# EAGLE design Motherboard 8bot (EAGLE 9.2.0)
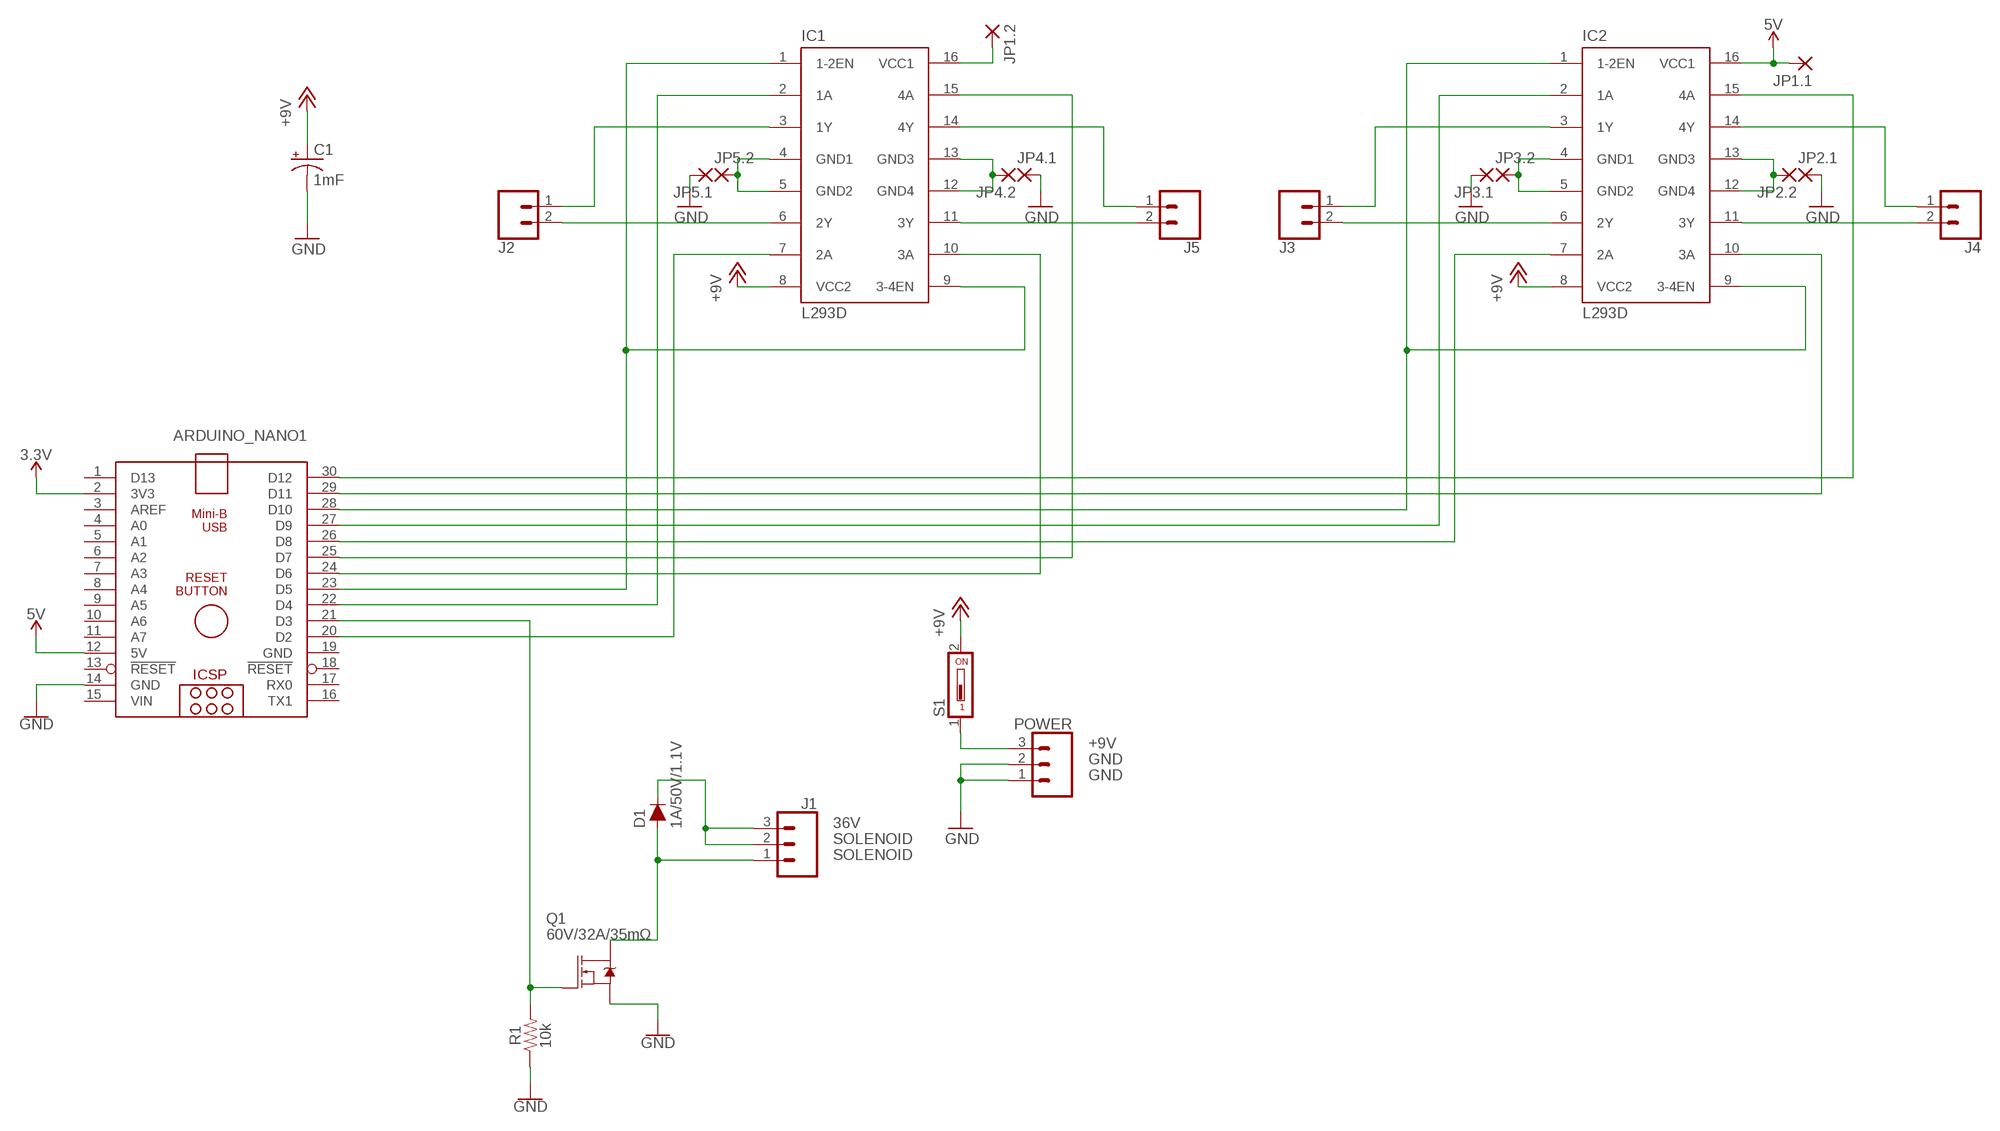
[diagram p0: schematic, sheet 1]

## Parts
ARDUINO_NANO1  ARDUINO_NANO  [ARDUINO_NANO]
C1  1mF  1000UF-RADIAL-5MM-25V-20%  [CPOL-RADIAL-5MM-10MM]
D1  1A/50V/1.1V  DIODE-PTH  [DIODE-1N4001]
IC1  L293D  [DIL16]
IC2  L293D  [DIL16]
J1  CONN_03-SCREW-5MM  [SCREWTERMINAL-5MM-3]
J2  CONN_02  [1X02]
J3  CONN_02  [1X02]
J4  CONN_02  [1X02]
J5  CONN_02  [1X02]
JP1.1  1,6/0,8  [1,6/0,8]
JP1.2  1,6/0,8  [1,6/0,8]
JP2.1  1,6/0,8  [1,6/0,8]
JP2.2  1,6/0,8  [1,6/0,8]
JP3.1  1,6/0,8  [1,6/0,8]
JP3.2  1,6/0,8  [1,6/0,8]
JP4.1  1,6/0,8  [1,6/0,8]
JP4.2  1,6/0,8  [1,6/0,8]
JP5.1  1,6/0,8  [1,6/0,8]
JP5.2  1,6/0,8  [1,6/0,8]
POWER  CONN_03-SCREW-5MM  [SCREWTERMINAL-5MM-3]
Q1  60V/32A/35mΩ  MOSFET-NCH-FQP30N06L  [TO220V]
R1  10k  10KOHM-HORIZ-1/4W-5%  [AXIAL-0.3]
S1  DS01  [DS-01]

## Nets
3.3V: ARDUINO_NANO1.2(3V3)
5V: ARDUINO_NANO1.12(5V) IC2.16(VCC1) JP1.1.1(P)
36V [36V]: D1.C J1.2 J1.3
+9V [9V]: C1.+ IC1.8(VCC2) IC2.8(VCC2) S1.2
EN1: ARDUINO_NANO1.23(D5) IC1.1(1-2EN) IC1.9(3-4EN)
EN2: ARDUINO_NANO1.28(D10) IC2.1(1-2EN) IC2.9(3-4EN)
GND: ARDUINO_NANO1.14(GND) C1.- JP2.1.1(P) JP3.1.1(P) JP4.1.1(P) JP5.1.1(P) POWER.1 POWER.2 Q1.3(S) R1.P$1
N$1: ARDUINO_NANO1.21(D3) Q1.1(G) R1.P$2
N$2: IC1.3(1Y) J2.1
N$3: IC1.6(2Y) J2.2
N$4: IC1.14(4Y) J5.1
N$5: IC1.11(3Y) J5.2
N$6: ARDUINO_NANO1.20(D2) IC1.7(2A)
N$7: ARDUINO_NANO1.22(D4) IC1.2(1A)
N$8: ARDUINO_NANO1.24(D6) IC1.10(3A)
N$9: IC2.3(1Y) J3.1
N$10: IC2.6(2Y) J3.2
N$11: IC2.14(4Y) J4.1
N$12: IC2.11(3Y) J4.2
N$13: IC1.16(VCC1) JP1.2.1(P)
N$14: ARDUINO_NANO1.27(D9) IC2.2(1A)
N$15: ARDUINO_NANO1.25(D7) IC1.15(4A)
N$16: ARDUINO_NANO1.29(D11) IC2.10(3A)
N$17: ARDUINO_NANO1.26(D8) IC2.7(2A)
N$18: ARDUINO_NANO1.30(D12) IC2.15(4A)
N$19: IC1.4(GND1) IC1.5(GND2) JP5.2.1(P)
N$20 [9V]: POWER.3 S1.1
N$21: IC1.12(GND4) IC1.13(GND3) JP4.2.1(P)
N$22: IC2.4(GND1) IC2.5(GND2) JP3.2.1(P)
N$23: IC2.12(GND4) IC2.13(GND3) JP2.2.1(P)
SOLENOID [36V]: D1.A J1.1 Q1.2(D)
Unconnected: ARDUINO_NANO1.1(D13) ARDUINO_NANO1.3(AREF) ARDUINO_NANO1.4(A0) ARDUINO_NANO1.5(A1) ARDUINO_NANO1.6(A2) ARDUINO_NANO1.7(A3) ARDUINO_NANO1.8(A4) ARDUINO_NANO1.9(A5) ARDUINO_NANO1.10(A6) ARDUINO_NANO1.11(A7) ARDUINO_NANO1.13(!RESET) ARDUINO_NANO1.16(TX1) ARDUINO_NANO1.17(RX0) ARDUINO_NANO1.18(!RESET)

## Power pins joined to a net without a drawn wire
GND: ARDUINO_NANO1.19(GND)
VIN: ARDUINO_NANO1.15(VIN)

## Library data of the parts
ARDUINO_NANO1 = ArduinoNanoV30:ARDUINO_NANO: Arduino Nano V3.0 Overview: The Arduino Nano is a small, complete, and breadboard-friendly board based on the ATmega328 (Arduino Nano 3.x) or ATmega168 (Arduino Nano 2.x). It has more or less the same functionality of the Arduino Duemilanove, but in a different package. It lacks only a DC power jack, and works with a Mini-B USB cable instead of a standard one. The Nano was designed and is being produced by Gravitech. Specifications: Microcontroller Atmel ATmega168 or ATmega328 Operating Voltage (logic level) 5 V Input Voltage (recommended) 7-12 V Input Voltage (limits) 6-20 V Digital I/O Pins 14 (of which 6 provide PWM output) Analog Input Pins 8 DC Current per I/O Pin 40 mA Flash Memory 16 KB (ATmega168) or 32 KB (ATmega328) of which 2 KB used by bootloader SRAM 1 KB (ATmega168) or 2 KB (ATmega328) EEPROM 512 bytes (ATmega168) or 1 KB (ATmega328) Clock Speed 16 MHz Dimensions 0.73" x 1.70" Length 45 mm Width 18 mm Weigth 5 g Power: The Arduino Nano can be powered via the Mini-B USB connection, 6-20V unregulated external power supply (pin 30), or 5V regulated external power supply (pin 27). The power source is automatically selected to the highest voltage source. Memory: The ATmega168 has 16 KB of flash memory for storing code (of which 2 KB is used for the bootloader); the ATmega328 has 32 KB, (also with 2 KB used for the bootloader). The ATmega168 has 1 KB of SRAM and 512 bytes of EEPROM (which can be read and written with the EEPROM library); the ATmega328 has 2 KB of SRAM and 1 KB of EEPROM. Input and Output: Each of the 14 digital pins on the Nano can be used as an input or output, using pinMode(), digitalWrite(), and digitalRead() functions. They operate at 5 volts. Each pin can provide or receive a maximum of 40 mA and has an internal pull-up resistor (disconnected by default) of 20-50 kOhms. In addition, some pins have specialized functions. Visit Arduino - ArduinoBoardNano <https://www.arduino.cc/en/Main/ArduinoBoardNano>
C1 = SparkFun-Capacitors:1000UF: 1,000µF/1mF ceramic capacitors A capacitor is a passive two-terminal electrical component used to store electrical energy temporarily in an electric field. CAP-08070; PROD_ID: CAP-09538
D1 = SparkFun-DiscreteSemi:DIODE: Diode These are standard reverse protection diodes and small signal diodes. SparkFun Products: SparkFun SparkPunk Sound Kit <https://www.sparkfun.com/products/11177> SparkFun ESP8266 Thing <https://www.sparkfun.com/products/13231>; PROD_ID: DIO-09176
IC1 IC2 = st-microelectronics:L293D: PUSH-PULL 4 CHANNEL DRIVER; MPN: L293D; OC_FARNELL: 9589619; OC_NEWARK: 56P8249
J1 POWER = SparkFun-Connectors:CONN_03: Multi connection point. Often used as Generic Header-pin footprint for 0.1 inch spaced/style header connections On any of the 0.1 inch spaced packages, you can populate with these: Break Away Headers - Straight <https://www.sparkfun.com/products/116> (PRT-00116) Break Away Male Headers - Right Angle <https://www.sparkfun.com/products/553> (PRT-00553) Female Headers <https://www.sparkfun.com/products/115> (PRT-00115) Break Away Headers - Machine Pin <https://www.sparkfun.com/products/117> (PRT-00117) Break Away Female Headers - Swiss Machine Pin <https://www.sparkfun.com/products/743> (PRT-00743) Stackable Header - 3 Pin (Female, 0.1") <https://www.sparkfun.com/products/13875> (PRT-13875) For SCREWTERMINALS and SPRING TERMINALS visit here: Screw Terimnals on SparkFun.com <https://www.sparkfun.com/search/results?term=Screw+Terminals> (5mm/3.5mm/2.54mm spacing) This device is also useful as a general connection point to wire up your design to another part of your project. Our various solder wires solder well into these plated through hole pads. Hook-Up Wire - Assortment (Stranded, 22 AWG) <https://www.sparkfun.com/products/11375> (PRT-11375) Hook-Up Wire - Assortment (Solid Core, 22 AWG) <https://www.sparkfun.com/products/11367> (PRT-11367) View the entire wire category on our website here <https://www.sparkfun.com/categories/141> Special notes: Molex polarized connector foot print use with SKU : PRT-08232 with associated crimp pins and housings.; PROD_ID: CONN-10134; SF_SKU: PRT-08433
J2-J5 = SparkFun-Connectors:CONN_02: Multi connection point. Often used as Generic Header-pin footprint for 0.1 inch spaced/style header connections On any of the 0.1 inch spaced packages, you can populate with these: Break Away Headers - Straight <https://www.sparkfun.com/products/116> (PRT-00116) Break Away Male Headers - Right Angle <https://www.sparkfun.com/products/553> (PRT-00553) Female Headers <https://www.sparkfun.com/products/115> (PRT-00115) Break Away Headers - Machine Pin <https://www.sparkfun.com/products/117> (PRT-00117) Break Away Female Headers - Swiss Machine Pin <https://www.sparkfun.com/products/743> (PRT-00743) For SCREWTERMINALS and SPRING TERMINALS visit here: Screw Terimnals on SparkFun.com <https://www.sparkfun.com/search/results?term=Screw+Terminals> (5mm/3.5mm/2.54mm spacing) This device is also useful as a general connection point to wire up your design to another part of your project. Our various solder wires solder well into these plated through hole pads. Hook-Up Wire - Assortment (Stranded, 22 AWG) <https://www.sparkfun.com/products/11375> (PRT-11375) Hook-Up Wire - Assortment (Solid Core, 22 AWG) <https://www.sparkfun.com/products/11367> (PRT-11367) View the entire wire category on our website here <https://www.sparkfun.com/categories/141> Special notes: Molex polarized connector foot print use with: PRT-08233 with associated crimp pins and housings. 2.54_SCREWTERM for use with PRT-10571. 3.5mm Screw Terminal footprints for PRT-08084 5mm Screw Terminal footprints for use with PRT-08432
JP1.1 JP1.2 JP2.1 JP2.2 JP3.1 JP3.2 JP4.1 JP4.2 JP5.1 JP5.2 = wirepad:1,6/0,8: THROUGH-HOLE PAD
Q1 = SparkFun-DiscreteSemi:MOSFET-NCH: N-channel MOSFETs Voltage controlled devices that allow control of high current outputs. SparkFun Products: SparkFun OpenScale <https://www.sparkfun.com/products/13261> SparkFun Digital Sandbox <https://www.sparkfun.com/products/12651> SparkFun Monster Moto Shield <https://www.sparkfun.com/products/10182> SparkFun MOSFET Power Controller <https://www.sparkfun.com/products/11214>; PROD_ID: TRANS-10060
R1 = SparkFun-Resistors:10KOHM: 10kΩ resistor A resistor is a passive two-terminal electrical component that implements electrical resistance as a circuit element. Resistors act to reduce current flow, and, at the same time, act to lower voltage levels within circuits. - Wikipedia; PROD_ID: RES-09435
S1 = switch-dil:DS01: DIL/CODE SWITCH; OC_FARNELL: unknown; OC_NEWARK: unknown

## Board
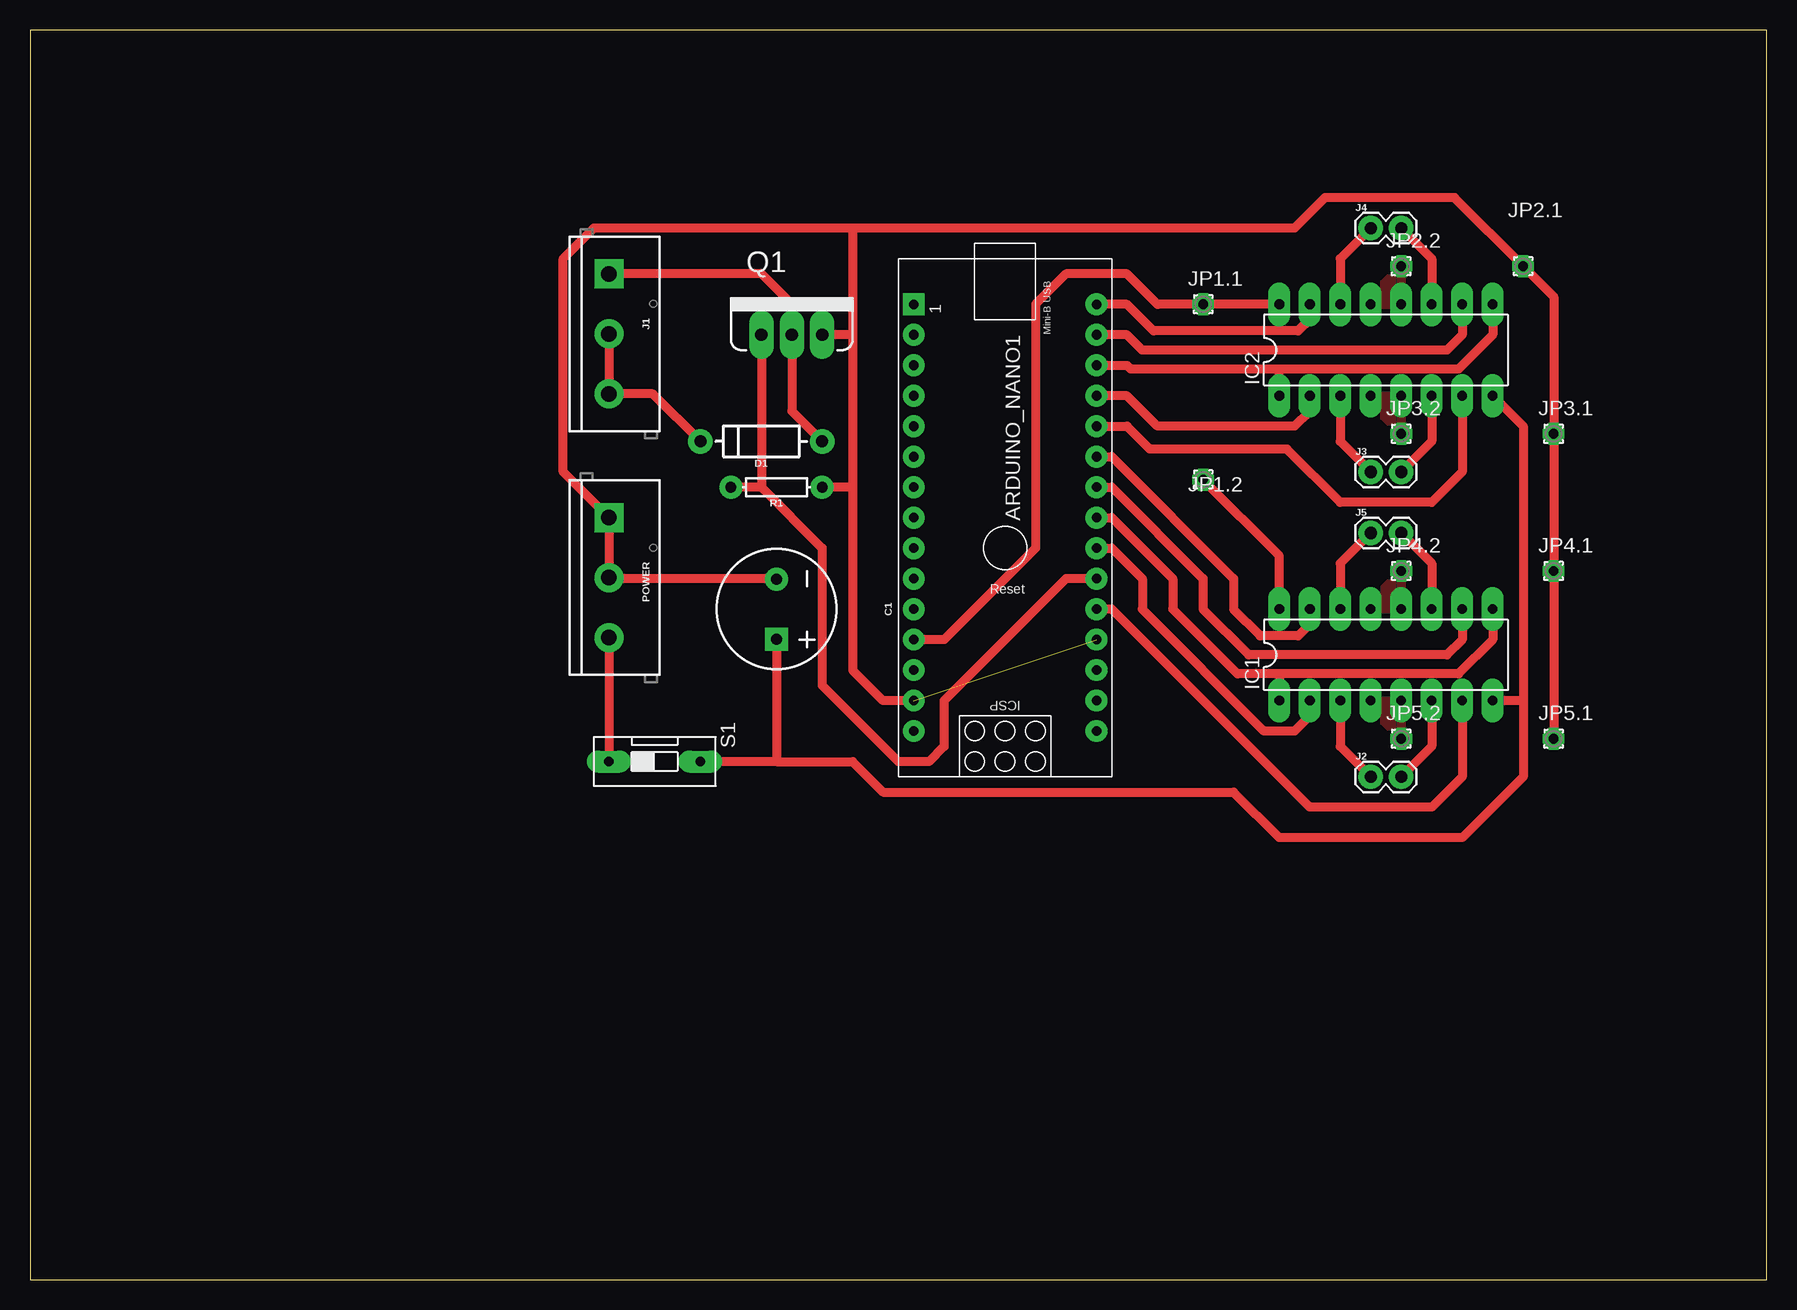
[diagram p1: board, top side]

Size 144.78 x 104.14 mm. Coordinates in mm from the lower left corner, seen from the top.
Outline: 0,0 144.78,0 144.78,104.14 0,104.14 0,0
Copper layers (1*16): Top 0.035mm / dielectric 1.5mm / Bottom 0.035mm
Design rules "Webb_PCB *": minimum track width 30mil, minimum drill 20mil, track to track 30mil, track to pad 30mil, pad to pad 20mil, via to via 20mil, smd to smd 10mil, copper to edge 100mil, drill to drill 20mil, minimum pad ring 20mil, minimum via ring 8mil, stop-mask expansion 4mil, vias tented up to drill 0mil, thermal gap 0mil

### Footprints (pad centres in the part's own frame; a part is rotated, then mirrored left to right if it is on the bottom)
ARDUINO_NANO = drill 0.8 square: 1 -20.32,-7.62 | drill 0.8: 2 -17.78,-7.62; 3 -15.24,-7.62; 4 -12.7,-7.62; 5 -10.16,-7.62; 6 -7.62,-7.62; 7 -5.08,-7.62; 8 -2.54,-7.62; 9 0,-7.62; 10 2.54,-7.62; 11 5.08,-7.62; 12 7.62,-7.62; 13 10.16,-7.62; 14 12.7,-7.62; 15 15.24,-7.62; 16 15.24,7.62; 17 12.7,7.62; 18 10.16,7.62; 19 7.62,7.62; 20 5.08,7.62; 21 2.54,7.62; 22 0,7.62; 23 -2.54,7.62; 24 -5.08,7.62; 25 -7.62,7.62; 26 -10.16,7.62; 27 -12.7,7.62; 28 -15.24,7.62; 29 -17.78,7.62; 30 -20.32,7.62
CPOL-RADIAL-5MM-10MM = drill 0.9 pad 1.93 square: + 2.5,0 | drill 0.9 pad 1.93: - -2.5,0
DIODE-1N4001 = drill 1 pad 1.981: A -5.08,0; C 5.08,0
DIL16 = drill 0.813 long: 1 -8.89,-3.81; 2 -6.35,-3.81; 3 -3.81,-3.81; 4 -1.27,-3.81; 5 1.27,-3.81; 6 3.81,-3.81; 7 6.35,-3.81; 8 8.89,-3.81; 9 8.89,3.81; 10 6.35,3.81; 11 3.81,3.81; 12 1.27,3.81; 13 -1.27,3.81; 14 -3.81,3.81; 15 -6.35,3.81; 16 -8.89,3.81
SCREWTERMINAL-5MM-3 = drill 1.3 pad 2.413 square: 1 0,0 | drill 1.3 pad 2.413: 2 5,0; 3 10,0
1X02 = drill 1.016 pad 1.88: 1 0,0; 2 2.54,0
1,6/0,8 = drill 0.813 pad 1.6 octagon: 1 0,0
TO220V = drill 1.016 long: 1 -2.54,0; 2 0,0; 3 2.54,0
AXIAL-0.3 = drill 0.9 pad 1.88: P$1 -3.81,0; P$2 3.81,0
DS-01 = drill 0.813 long: 1 0,-3.81; 2 0,3.81

### Placement (x,y rotation side)
ARDUINO_NANO1  81.28,60.96 270 top
C1  62.23,55.88 270 top
D1  60.96,69.85 180 top
IC1  113.03,52.07 0 top
IC2  113.03,77.47 0 top
J1  48.26,83.82 270 top
J2  111.76,41.91 0 top
J3  111.76,67.31 0 top
J4  111.76,87.63 0 top
J5  111.76,62.23 0 top
JP1.1  97.79,81.28 0 top
JP1.2  97.79,66.67 0 top
JP2.1  124.46,84.45 0 top
JP2.2  114.3,84.45 0 top
JP3.1  127,70.48 0 top
JP3.2  114.3,70.48 0 top
JP4.1  127,59.05 0 top
JP4.2  114.3,59.05 0 top
JP5.1  127,45.09 0 top
JP5.2  114.3,45.09 0 top
POWER  48.26,63.5 270 top
Q1  63.5,78.74 0 top
R1  62.23,66.04 180 top
S1  52.07,43.18 270 top

### Tracks (layer width: path | path; a pad name or v marks a point on that pad's centre or on a via)
5V
  Top 0.762: IC2.16 JP1.1.1 93.98,81.28 91.44,83.82 86.36,83.82 83.82,81.28 83.82,60.96 76.2,53.34 ARDUINO_NANO1.12
36V
  Top 0.762: D1.C 51.91,73.82 J1.3 J1.2
+9V
  Top 0.762: 124.46,48.26 124.46,41.91 119.38,36.83 104.14,36.83 100.33,40.64 71.12,40.64 68.58,43.18 62.23,43.18 | 124.46,48.26 124.46,71.12 IC2.8 | 124.46,48.26 IC1.8 | 62.23,43.18 S1.2 | C1.+ 62.23,43.18
EN1
  Top 0.762: ARDUINO_NANO1.23 90.17,63.5 95.25,58.42 95.25,55.88 100.65,50.48 104.14,50.48 | 104.14,50.48 IC1.1 | IC1.9 121.92,53.34 119.06,50.48 104.14,50.48
EN2
  Top 0.762: IC2.9 121.92,78.74 119.06,75.88 104.14,75.88 | 104.14,75.88 91.76,75.88 91.44,76.2 ARDUINO_NANO1.28 | IC2.1 104.14,75.88
GND  (1 unrouted)
  Top 0.762: C1.- 62.23,58.42 48.34,58.42 POWER.2 POWER.1 44.45,67.31 44.45,85.09 46.99,87.63 68.58,87.63 | 68.58,66.04 R1.P$1 | ARDUINO_NANO1.14 71.12,48.26 68.58,50.8 68.58,66.04 | 68.58,78.74 Q1.3 | 68.58,78.74 68.58,66.04 | 68.58,87.63 68.58,78.74 | 68.58,87.63 105.41,87.63 107.95,90.17 118.75,90.17 JP2.1.1 127,81.92 JP3.1.1 JP4.1.1 JP5.1.1
N$1
  Top 0.762: ARDUINO_NANO1.21 86.36,58.42 76.2,48.26 76.2,44.45 74.93,43.18 72.39,43.18 66.04,49.53 66.04,60.96 60.96,66.04 | Q1.1 60.96,66.04 | 60.96,66.04 R1.P$2
N$2
  Top 0.762: IC1.3 109.22,44.45 J2.1
N$3
  Top 0.762: J2.2 116.84,44.45 IC1.6
N$4
  Top 0.762: J5.1 109.22,59.69 IC1.14
N$5
  Top 0.762: IC1.11 116.84,59.69 J5.2
N$6
  Top 0.762: ARDUINO_NANO1.20 90.17,55.88 106.68,39.37 116.84,39.37 119.38,41.91 IC1.7
N$7
  Top 0.762: ARDUINO_NANO1.22 90.17,60.96 92.71,58.42 92.71,55.88 102.87,45.72 105.41,45.72 106.68,46.99 IC1.2
N$8
  Top 0.762: IC1.10 119.38,53.34 118.11,52.07 101.6,52.07 97.79,55.88 97.79,58.42 90.17,66.04 ARDUINO_NANO1.24
N$9
  Top 0.762: J3.1 109.22,69.85 IC2.3
N$10
  Top 0.762: IC2.6 116.84,69.85 J3.2
N$11
  Top 0.762: IC2.14 109.22,85.09 J4.1
N$12
  Top 0.762: IC2.11 116.84,85.09 J4.2
N$13
  Top 0.762: IC1.16 104.14,60.33 JP1.2.1
N$14
  Top 0.762: IC2.2 106.68,72.39 105.41,71.12 93.98,71.12 91.44,73.66 ARDUINO_NANO1.27
N$15
  Top 0.762: IC1.15 106.68,54.61 105.73,53.66 102.55,53.66 100.33,55.88 100.33,58.42 90.17,68.58 ARDUINO_NANO1.25
N$16
  Top 0.762: ARDUINO_NANO1.29 91.44,78.74 92.71,77.47 118.11,77.47 119.38,78.74 IC2.10
N$17
  Top 0.762: IC2.7 119.38,67.31 116.84,64.77 109.22,64.77 104.78,69.22 93.34,69.22 91.44,71.12 ARDUINO_NANO1.26
N$18
  Top 0.762: ARDUINO_NANO1.30 91.44,81.28 93.66,79.06 105.73,79.06 106.68,80.01 IC2.15
N$19
  pour Top: 114.3,48.26 114.3,45.09 111.76,47.62 111.76,48.26
N$20
  Top 0.762: POWER.3 S1.1
N$21
  pour Top: 114.3,59.05 114.3,55.88 111.76,55.88 111.76,56.52
N$22
  pour Top: 111.76,73.66 114.3,73.66 114.3,70.48 111.76,73.03
N$23
  pour Top: 111.76,81.28 114.3,81.28 114.3,84.45 111.76,81.92
SOLENOID
  Top 0.762: J1.1 60.96,83.82 63.5,81.28 Q1.2 63.5,72.39 D1.A